# Altium schematic sheet Voltage Measurement.SchDoc
size B; DrawnBy: Ross Harvey; Engineer: Ross Harvey; Revision: A; SheetNumber: 5; SheetTotal: 7
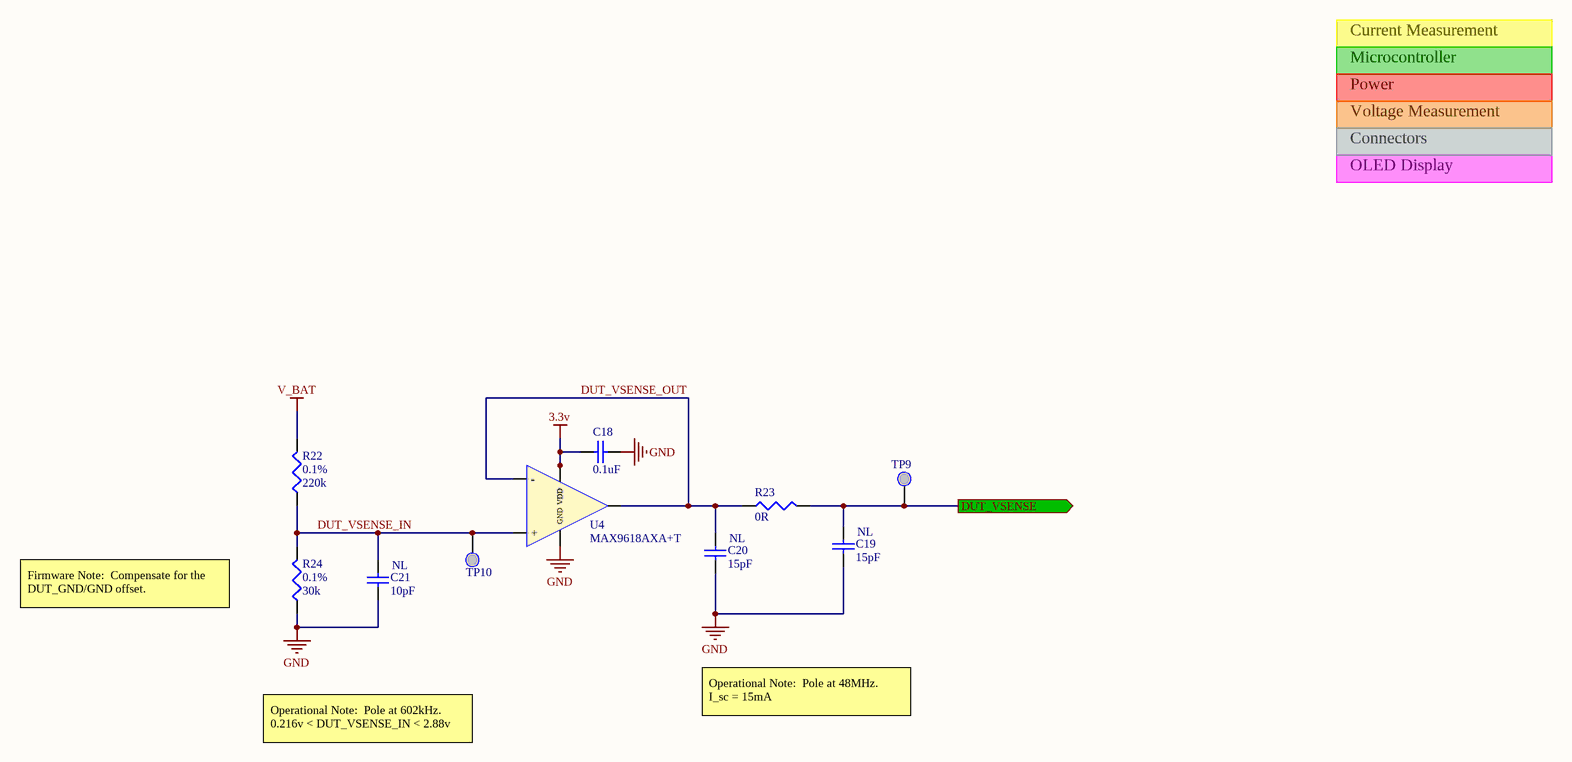
[diagram p0: Voltage Measurement.SchDoc]

## Parts
C18  0.1uF  [CAP0402R]
C19  LOAD: NL  [CAP0402R]  (hidden comment: 15pF)
C20  LOAD: NL  [CAP0402R]  (hidden comment: 15pF)
C21  LOAD: NL  [CAP0402R]  (hidden comment: 10pF)
R22  Tolerance: 0.1%  [RES0603R]  (hidden comment: 220k)
R23  0R  [RES0402R]
R24  Tolerance: 0.1%  [RES0603R]  (hidden comment: 30k)
TP9  NONE  [TESTPOINT - 1.5mm Round Pad]  (value not drawn)
TP10  NONE  [TESTPOINT - 1.5mm Round Pad]  (value not drawn)
U4  MAX9618AXA+T  [SC70]

## Ports
DUT_VSENSE (out)

## Nets
3.3v: C18.1 U4.5(VDD) U4.6(VDD)
GND: C18.2 C19.2 C20.2 C21.2 R24.1 U4.2(GND)
V_BAT: R22.2
DUT_VSENSE: C19.1 R23.2 TP9.1 ; port DUT_VSENSE
DUT_VSENSE_IN: C21.1 R22.1 R24.2 TP10.1 U4.1(+)
DUT_VSENSE_OUT: C20.1 R23.1 U4.3(-) U4.4(OUT)

## Notes on the sheet
- Current Measurement
- Microcontroller
- Power
- Voltage Measurement
- OLED Display
- Connectors
- Firmware Note:  Compensate for the DUT_GND/GND offset.
- Operational Note:  Pole at 48MHz.
  I_sc = 15mA
- Operational Note:  Pole at 602kHz.
  0.216v < DUT_VSENSE_IN < 2.88v

## Library data of the parts
C18 = 0.1uF (0402): Tolerance: 20%; MFG_PN: VJ0402G104MXQCW1BC; MFG: Vishay; Voltage: 10v; LOAD: NL; Value: 0.1uF
C19 C20 = 15pF (0402): Tolerance: 5%; MFG_PN: VJ0402A150JXACW1BC; MFG: Vishay; Voltage: 50v; Value: 15pF
C21 = 10pF (0402): Tolerance: 5%; MFG_PN: VJ0402A100JXACW1BC; MFG: Vishay; Voltage: 50v; Value: 10pF
R22 = 220k 0.1% (0603): POWER: 0.1W; MFG1_PN: TNPW0603220KBEEA; MFG1: Vishay; Load: NL; Value: 220k
R23 = 0R (0402): MFG_PN: CRCW04020000Z0ED; MFG: Vishay; Load: NL; Value: 0R
R24 = 30k 0.1% (0603): POWER: 0.1W; MFG1_PN: TNPW060330K0BEEA; MFG1: Vishay; Load: NL; Value: 30k
TP9 TP10 = Testpoint 1.5mm SMD: 1.5mm Testpoint
U4 = MAX9618AXA: Op Amp - 1 Channel Zero Drift; LOAD: NL; MFG: MAXIM; GBP: 1.5MHz; MFG_PN: MAX9618AXA+T